# EAGLE schematic 5chMixer (EAGLE 7.5.0)
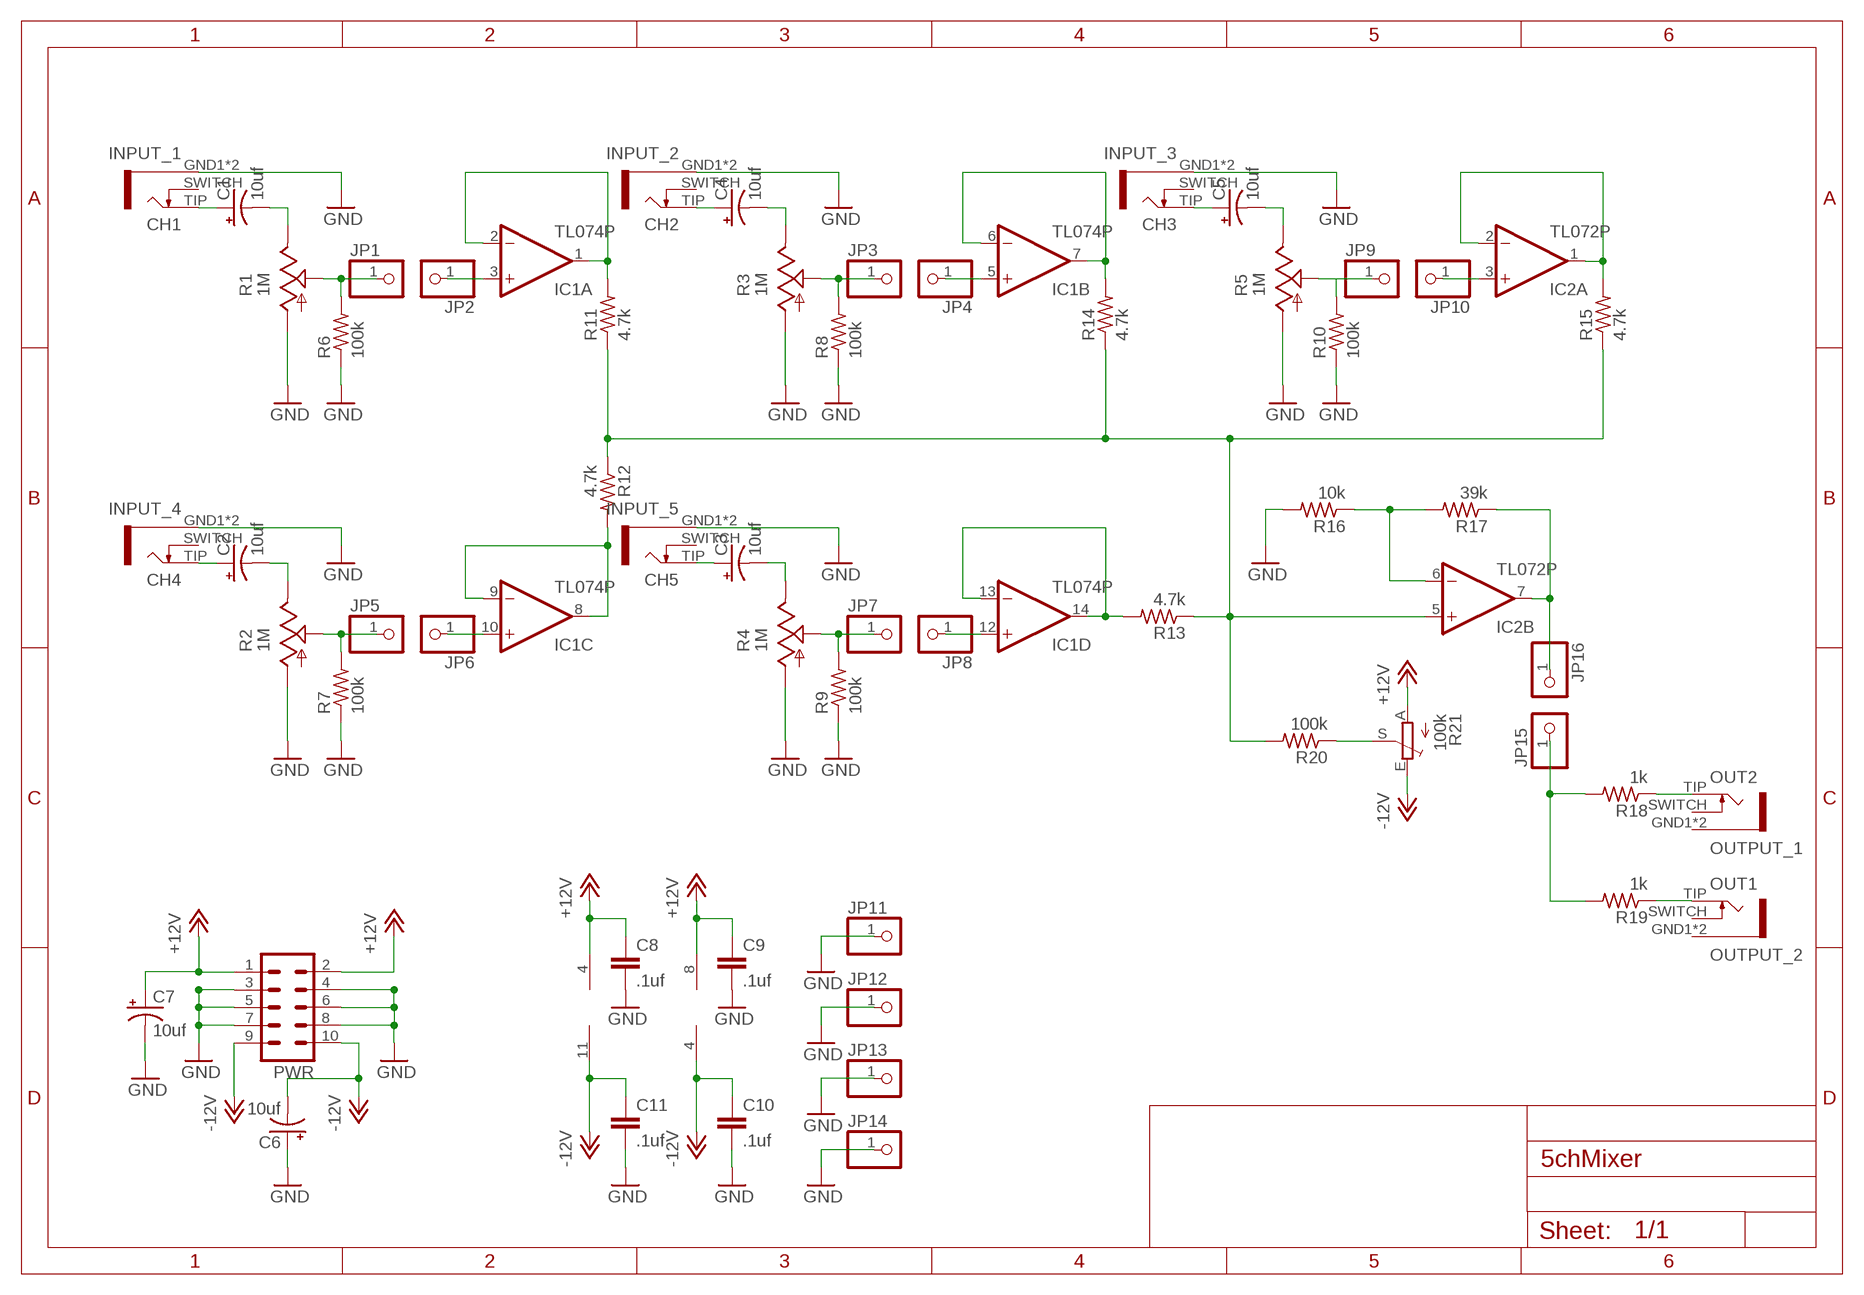
[diagram p0: schematic, sheet 1]

## Parts
C1  10uf  CPOL-USE2.5-5  [E2,5-5]
C2  10uf  CPOL-USE2.5-5  [E2,5-5]
C3  10uf  CPOL-USE2.5-5  [E2,5-5]
C4  10uf  CPOL-USE2.5-5  [E2,5-5]
C5  10uf  CPOL-USE2.5-5  [E2,5-5]
C6  10uf  CPOL-USE2.5-5  [E2,5-5]
C7  10uf  CPOL-USE2.5-5  [E2,5-5]
C8  .1uf  C-EU050-024X044  [C050-024X044]
C9  .1uf  C-EU050-024X044  [C050-024X044]
C10  .1uf  C-EU050-024X044  [C050-024X044]
C11  .1uf  C-EU050-024X044  [C050-024X044]
CH1  INPUT_1  PJ301BMPJ301BM  [PJ301BM]
CH2  INPUT_2  PJ301BMPJ301BM  [PJ301BM]
CH3  INPUT_3  PJ301BMPJ301BM  [PJ301BM]
CH4  INPUT_4  PJ301BMPJ301BM  [PJ301BM]
CH5  INPUT_5  PJ301BMPJ301BM  [PJ301BM]
IC1  TL074P  [DIL14]
IC2  TL072P  [DIL08]
JP1  PINHD-1X1  [1X01]
JP2  PINHD-1X1  [1X01]
JP3  PINHD-1X1  [1X01]
JP4  PINHD-1X1  [1X01]
JP5  PINHD-1X1  [1X01]
JP6  PINHD-1X1  [1X01]
JP7  PINHD-1X1  [1X01]
JP8  PINHD-1X1  [1X01]
JP9  PINHD-1X1  [1X01]
JP10  PINHD-1X1  [1X01]
JP11  PINHD-1X1  [1X01]
JP12  PINHD-1X1  [1X01]
JP13  PINHD-1X1  [1X01]
JP14  PINHD-1X1  [1X01]
JP15  PINHD-1X1  [1X01]
JP16  PINHD-1X1  [1X01]
OUT1  OUTPUT_2  PJ301BMPJ301BM  [PJ301BM]
OUT2  OUTPUT_1  PJ301BMPJ301BM  [PJ301BM]
PWR  ML10  [ML10]
R1  1M  ALPHA-9MMA  [EVUF]
R2  1M  ALPHA-9MMA  [EVUF]
R3  1M  ALPHA-9MMA  [EVUF]
R4  1M  ALPHA-9MMA  [EVUF]
R5  1M  ALPHA-9MMA  [EVUF]
R6  100k  R-US_0204/7  [0204/7]
R7  100k  R-US_0204/7  [0204/7]
R8  100k  R-US_0204/7  [0204/7]
R9  100k  R-US_0204/7  [0204/7]
R10  100k  R-US_0204/7  [0204/7]
R11  4.7k  R-US_0207/2V  [0207/2V]
R12  4.7k  R-US_0207/2V  [0207/2V]
R13  4.7k  R-US_0207/2V  [0207/2V]
R14  4.7k  R-US_0207/2V  [0207/2V]
R15  4.7k  R-US_0207/2V  [0207/2V]
R16  10k  R-US_0207/2V  [0207/2V]
R17  39k  R-US_0207/2V  [0207/2V]
R18  1k  R-US_0204/7  [0204/7]
R19  1k  R-US_0204/7  [0204/7]
R20  100k  R-US_0207/2V  [0207/2V]
R21  100k  TRIM_1234-S64YW  [S64YW]

## Nets
+12V: C7.+ C8.1 C9.1 IC1.4(P:V+) IC2.8(P:V+) PWR.1 PWR.2 R21.A
-12V: C6.- C10.1 C11.1 IC1.11(P:V-) IC2.4(P:V-) PWR.9 PWR.10 R21.E
GND: C6.+ C7.- C8.2 C9.2 C10.2 C11.2 CH1.GND1 CH1.GND2 CH2.GND1 CH2.GND2 CH3.GND1 CH3.GND2 CH4.GND1 CH4.GND2 CH5.GND1 CH5.GND2 JP11.1 JP12.1 JP13.1 JP14.1 PWR.3 PWR.4 PWR.5 PWR.6 PWR.7 PWR.8 R1.1(A) R2.1(A) R3.1(A) R4.1(A) R5.1(A) R6.1 R7.1 R8.1 R9.1 R10.1 R16.2
N$1: IC1.6(B:-IN) IC1.7(B:OUT) R14.2
N$2: IC1.1(A:OUT) IC1.2(A:-IN) R11.2
N$3: IC1.8(C:OUT) IC1.9(C:-IN) R12.2
N$4: JP5.1 R2.2(S) R7.2
N$5: JP1.1 R1.2(S) R6.2
N$6: JP3.1 R3.2(S) R8.2
N$7: JP7.1 R4.2(S) R9.2
N$8: JP9.1 R5.2(S) R10.2
N$9: IC1.13(D:-IN) IC1.14(D:OUT) R13.2
N$10: C1.+ CH1.TIP
N$11: C2.+ CH4.TIP
N$12: C4.+ CH2.TIP
N$13: C5.+ CH3.TIP
N$14: IC2.1(A:OUT) IC2.2(A:-IN) R15.2
N$15: C1.- R1.3(E)
N$16: C2.- R2.3(E)
N$17: C4.- R3.3(E)
N$18: C3.- R4.3(E)
N$19: C3.+ CH5.TIP
N$20: IC2.5(B:+IN) R11.1 R12.1 R13.1 R14.1 R15.1 R20.2
N$21: IC1.3(A:+IN) JP2.1
N$22: IC1.5(B:+IN) JP4.1
N$23: JP15.1 R18.2 R19.2
N$24: R20.1 R21.S
N$25: C5.- R5.3(E)
N$26: IC2.6(B:-IN) R16.1 R17.2
N$27: OUT2.TIP R18.1
N$28: OUT1.TIP R19.1
N$29: IC1.10(C:+IN) JP6.1
N$30: IC1.12(D:+IN) JP8.1
N$31: IC2.3(A:+IN) JP10.1
N$32: IC2.7(B:OUT) JP16.1 R17.1
Unconnected: CH1.SWITCH CH2.SWITCH CH3.SWITCH CH4.SWITCH CH5.SWITCH OUT1.GND1 OUT1.GND2 OUT1.SWITCH OUT2.GND1 OUT2.GND2 OUT2.SWITCH R21.S@1(S)

## Library data of the parts
C1-C7 = resistor:CPOL-US: POLARIZED CAPACITOR, American symbol
C8-C11 = resistor:C-EU: CAPACITOR, European symbol
CH1-CH5 OUT1 OUT2 = gerbster:PJ301BM
IC1 = linear:TL074: OP AMP
IC2 = TomW:TL072: OP AMP
JP1-JP16 = pinhead:PINHD-1X1: PIN HEADER
PWR = con-ml:ML10: HARTING; OC_FARNELL: unknown; OC_NEWARK: unknown
R1-R5 = TomW:ALPHA-9MM: 9 mm Square Rotary Potentiometers Source: Panasonic
R6-R20 = resistor:R-US_: RESISTOR, American symbol
R21 = pot:TRIM_1234-: POTENTIOMETER